# EAGLE design Joy2PS2_rev2_3 (EAGLE 7.6.0)
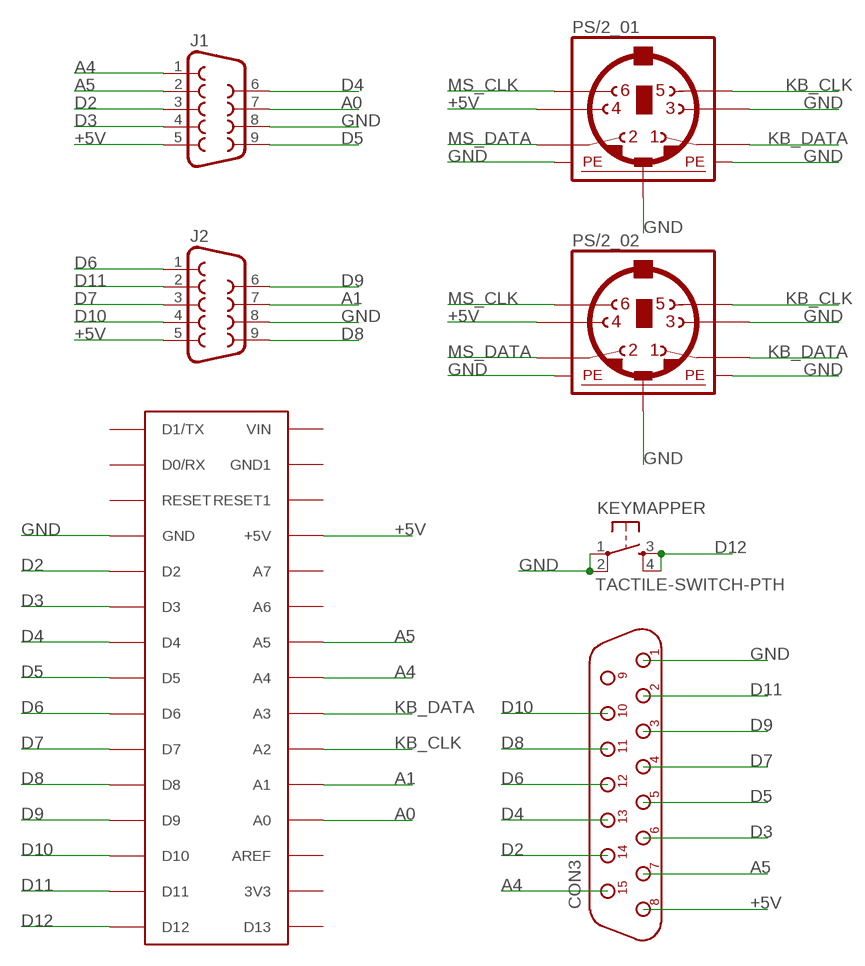
[diagram p0: schematic, sheet 1]

## Parts
ARDUINONANO  ARDUINONANO  [PDIP-32]
CON3  DB15M/90  [D-15M/90]
J1  DB9MALE  [DB9_MALE]
J2  DB9MALE  [DB9_MALE]
KEYMAPPER  TACTILE-SWITCH-PTH  [TAC-SWITCH-PTH]
PS/2_01  MINI_DIN_6  [M_DIN6]
PS/2_02  MINI_DIN_6  [M_DIN6]

## Nets
+5V: ARDUINONANO.+5V CON3.8 J1.5 J2.5 PS/2_01.4 PS/2_02.4
A0: ARDUINONANO.A0 J1.7
A1: ARDUINONANO.A1 J2.7
A4: ARDUINONANO.A4 CON3.15 J1.1
A5: ARDUINONANO.A5 CON3.7 J1.2
D2: ARDUINONANO.D2 CON3.14 J1.3
D3: ARDUINONANO.D3 CON3.6 J1.4
D4: ARDUINONANO.D4 CON3.13 J1.6
D5: ARDUINONANO.D5 CON3.5 J1.9
D6: ARDUINONANO.D6 CON3.12 J2.1
D7: ARDUINONANO.D7 CON3.4 J2.3
D8: ARDUINONANO.D8 CON3.11 J2.9
D9: ARDUINONANO.D9 CON3.3 J2.6
D10: ARDUINONANO.D10 CON3.10 J2.4
D11: ARDUINONANO.D11 CON3.2 J2.2
D12: ARDUINONANO.D12 KEYMAPPER.3 KEYMAPPER.4
GND: ARDUINONANO.GND CON3.1 J1.8 J2.8 KEYMAPPER.1 KEYMAPPER.2 PS/2_01.3 PS/2_01.SH1(PE1) PS/2_01.SH2(PE2) PS/2_01.SH3(PE3) PS/2_02.3 PS/2_02.SH1(PE1) PS/2_02.SH2(PE2) PS/2_02.SH3(PE3)
KB_CLK: ARDUINONANO.A2 PS/2_01.5 PS/2_02.5
KB_DATA: ARDUINONANO.A3 PS/2_01.1 PS/2_02.1
MS_CLK: PS/2_01.6 PS/2_02.6
MS_DATA: PS/2_01.2 PS/2_02.2
Unconnected: ARDUINONANO.3V3 ARDUINONANO.A6 ARDUINONANO.A7 ARDUINONANO.AREF ARDUINONANO.D0/RX ARDUINONANO.D1/TX ARDUINONANO.D13 ARDUINONANO.GND1 ARDUINONANO.RESET ARDUINONANO.RESET1 ARDUINONANO.VIN CON3.9

## Library data of the parts
ARDUINONANO = jet-lib2:ARDUINONANO
CON3 = connect:DB15M/90
J1 J2 = SparkFun-Connectors:DB9: DB9 Connector Standard DB9 (D-Sub 9) serial connector. Can be used for CAN bus as well as RS485 and RS232. Footprint production proven. Spark Fun Electronics SKU : PRT-00429; PROD_ID: CONN-09904
KEYMAPPER = GeekAmmo:TACTILE-SWITCH: Tactile Switch 4 Pins, SPST NO
PS/2_01 PS/2_02 = mini_din:MINI_DIN_6

## Board
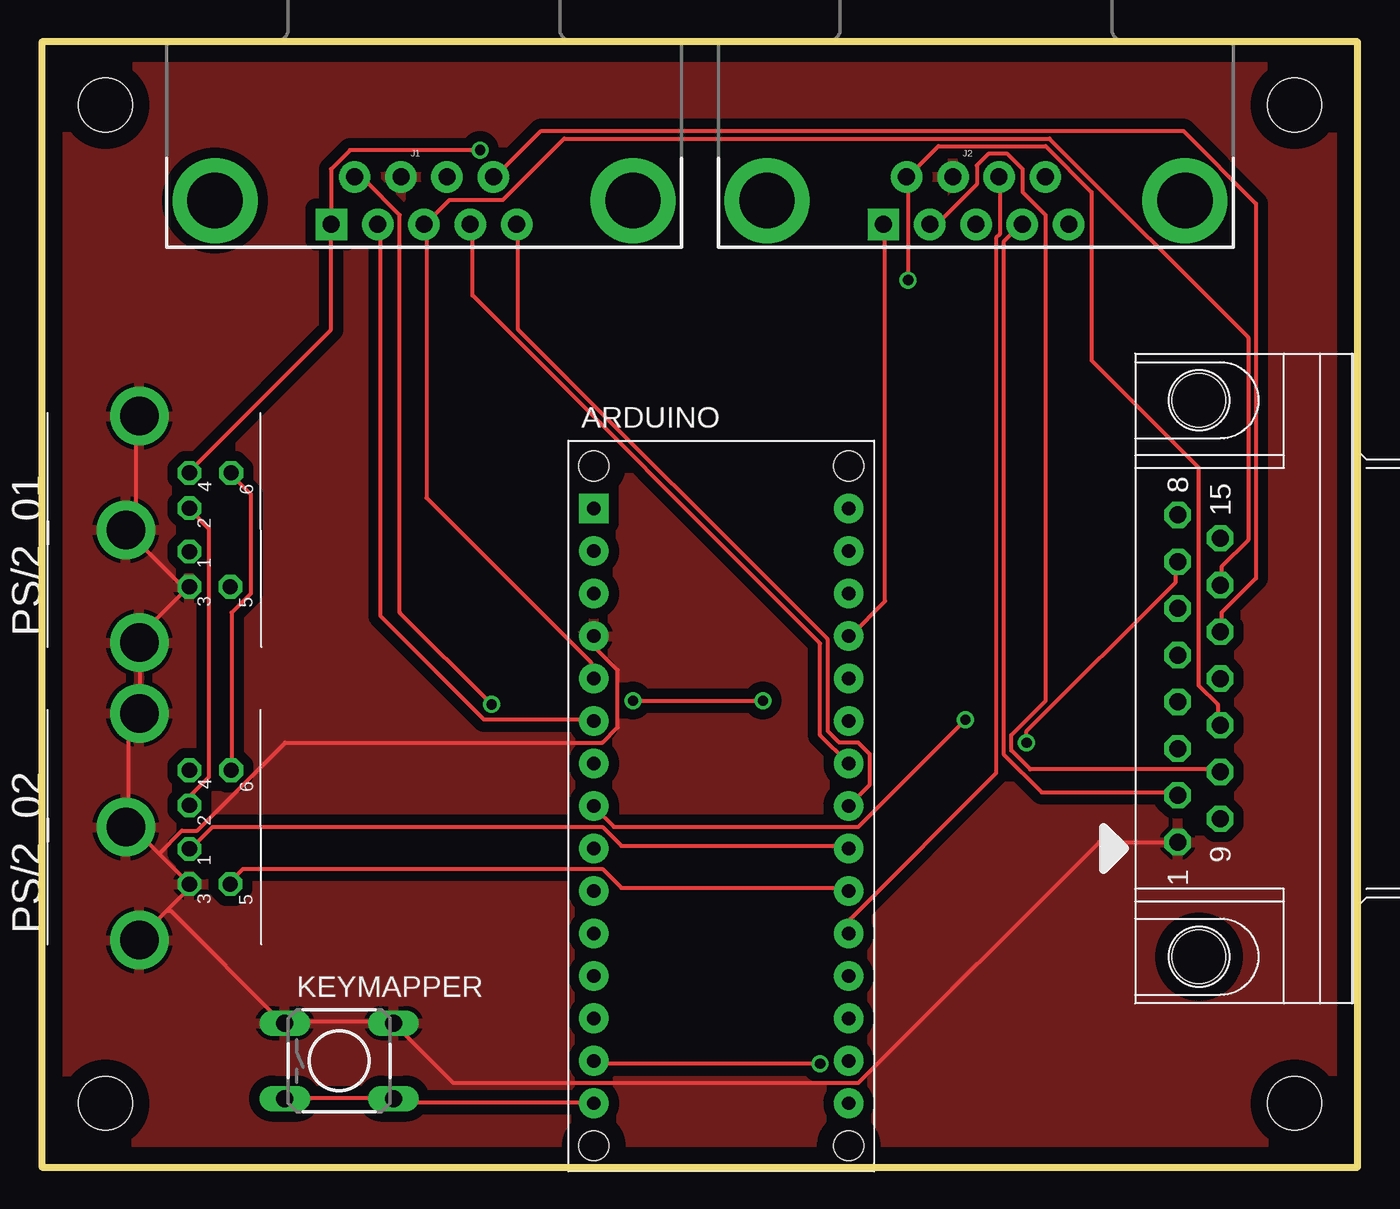
[diagram p1: board, top side]
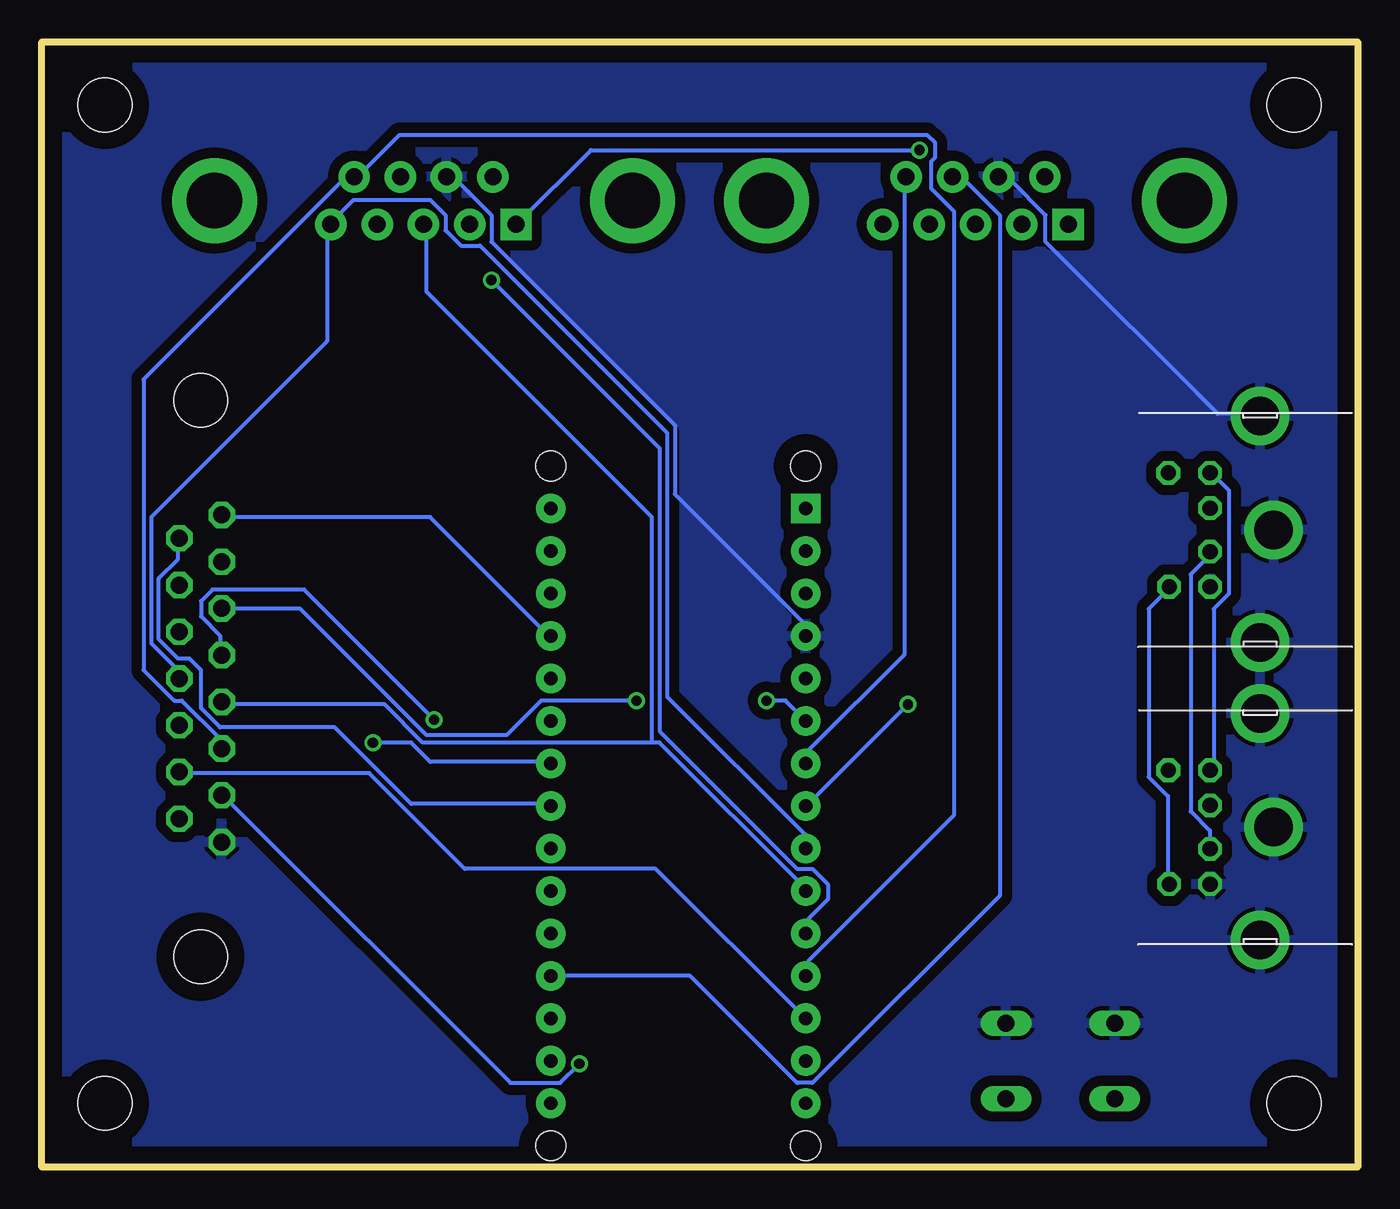
[diagram p2: board, bottom side, seen from below]

Size 78.71 x 67.28 mm. Coordinates in mm from the lower left corner, seen from the top.
Outline: 0,0 78.71,0 78.71,67.28 0,67.28 0,0
Copper layers (1*16): Top 0.035mm / dielectric 1.5mm / Bottom 0.035mm
Design rules "default": minimum track width 10mil, minimum drill 24mil, track to track 8mil, track to pad 8mil, pad to pad 8mil, via to via 8mil, smd to smd 8mil, copper to edge 40mil, drill to drill 8mil, minimum pad ring 10mil, minimum via ring 8mil, stop-mask expansion 4mil, vias tented up to drill 0mil, thermal gap 10mil
Holes 3.2 mm at 74.93,63.5 74.93,3.81 3.81,63.5 3.81,3.81

### Footprints (pad centres in the part's own frame; a part is rotated, then mirrored left to right if it is on the bottom)
PDIP-32 = drill 0.8 pad 1.778: 3V3 15.24,-35.56; +5V 15.24,-10.16; A0 15.24,-30.48; A1 15.24,-27.94; A2 15.24,-25.4; A3 15.24,-22.86; A4 15.24,-20.32; A5 15.24,-17.78; A6 15.24,-15.24; A7 15.24,-12.7; AREF 15.24,-33.02; D0/RX 0,-5.08; D2 0,-12.7; D3 0,-15.24; D4 0,-17.78; D5 0,-20.32; D6 0,-22.86; D7 0,-25.4; D8 0,-27.94; D9 0,-30.48; D10 0,-33.02; D11 0,-35.56; D12 0,-38.1; D13 15.24,-38.1; GND 0,-10.16; GND1 15.24,-5.08; RESET 0,-7.62; RESET1 15.24,-7.62; VIN 15.24,-2.54 | drill 0.8 pad 1.778 square: D1/TX 0,-2.54 | hole 1.778: 0,0; 0,-40.64; 15.24,-40.64; 15.24,0
D-15M/90 = drill 1.016 pad 1.575 octagon: 1 9.779,-1.27; 2 6.985,-1.27; 3 4.191,-1.27; 4 1.397,-1.27; 5 -1.397,-1.27; 6 -4.191,-1.27; 7 -6.985,-1.27; 8 -9.779,-1.27; 9 8.382,1.27; 10 5.588,1.27; 11 2.794,1.27; 12 0,1.27; 13 -2.794,1.27; 14 -5.588,1.27; 15 -8.382,1.27 | hole 3.2: 16.637,0; -16.637,0
DB9_MALE = drill 1.016 pad 1.88: 1 5.54,-1.42; 2 2.77,-1.42; 3 0,-1.42; 4 -2.77,-1.42; 6 4.15,1.42; 7 1.38,1.42; 8 -1.38,1.42; 9 -4.15,1.42 | drill 1.016 pad 1.88 square: 5 -5.54,-1.42 | drill 3.302 pad 5.08: G1 -12.5,0; G2 12.5,0
TAC-SWITCH-PTH = drill 1.016 pad 1.524 long: 1 -3.251,2.261; 2 3.251,2.261; 3 -3.251,-2.261; 4 3.251,-2.261
M_DIN6 = drill 0.9 pad 1.422 octagon: 1 -1.3,-3.75; 2 1.3,-3.75; 3 -3.4,-3.75; 4 3.4,-3.75; 5 -3.4,-6.2; 6 3.4,-6.25 | drill 2.3 pad 3.5: SH1 6.8,-0.75; SH2 0,0.05; SH3 -6.75,-0.75

### Placement (x,y rotation side)
ARDUINONANO  33.02,41.91 0 top
CON3  69.22,29.21 270 top
J1  22.86,57.78 0 top
J2  55.88,57.78 0 top
KEYMAPPER  17.78,6.35 0 top
PS/2_01  5.08,38.1 90 top
PS/2_02  5.08,20.32 90 top

### Tracks (layer width: path | path; a pad name or v marks a point on that pad's centre or on a via)
+5V  (via drill 0.61)
  Top 0.254: PS/2_01.4 8.84,41.6 17.3,50.06 17.3,56.24 J1.5 17.3,56.46 17.3,59.66 18.44,60.81 v26.21,60.81 | J2.5 50.44,56.24 50.44,33.83 48.39,31.77 ARDUINONANO.+5V
  Bottom 0.254: PS/2_02.4 8.61,23.77 8.61,33.38 7.7,34.29 7.7,40.46 8.61,41.38 PS/2_01.4 | CON3.8 67.82,38.86 55.47,38.86 48.39,31.77 ARDUINONANO.+5V | v26.21,60.81 45.87,60.81 50.22,56.46 J2.5
A0
  Bottom 0.254: ARDUINONANO.A0 39.93,11.43 33.53,5.03 32.61,5.03 21.41,16.23 21.41,56.92 23.47,58.98 24.16,58.98 J1.7
A1
  Top 0.254: ARDUINONANO.A1 48.39,14.17 48.39,14.86 57.07,23.55 57.07,55.55 57.3,55.78 57.3,58.98 J2.7
A4
  Top 0.254: ARDUINONANO.A4 49.53,22.86 49.53,24.69 48.84,25.38 47.7,25.38 47.02,26.06 47.02,31.55 28.5,50.06 28.5,56.24 J1.1
  Bottom 0.254: CON3.15 70.56,37.49 70.56,36.35 71.7,35.2 71.7,31.55 70.56,30.4 69.88,30.4 69.19,29.72 69.19,27.43 68.05,26.29 61.19,26.29 56.62,21.72 48.39,21.72 ARDUINONANO.A4
A5  (via drill 0.61)
  Top 0.254: v58.9,25.38 58.9,26.06 67.82,34.98 67.82,36.12 CON3.7 | ARDUINONANO.A5 46.56,25.83 46.56,31.32 25.76,52.12 25.76,56.24 J1.2
  Bottom 0.254: v58.9,25.38 56.62,25.38 55.47,24.23 48.39,24.23 ARDUINONANO.A5
D2
  Top 0.254: CON3.14 70.56,34.98 70.56,35.89 72.16,37.49 72.16,49.61 60.27,61.49 31.24,61.49 27.58,57.84 24.38,57.84 23.01,56.46 J1.3 23.01,56.24 23.01,40.01 32.84,30.18 32.84,29.26 ARDUINONANO.D2
D3  (via drill 0.61)
  Top 0.254: v35.36,27.89 v43.13,27.89 | J1.4 20.27,56.24 20.27,32.92 26.44,26.75 32.84,26.75 ARDUINONANO.D3
  Bottom 0.254: v43.13,27.89 48.84,27.89 50.9,25.83 55.7,25.83 63.25,33.38 67.82,33.38 CON3.6 | v35.36,27.89 34.21,27.89 33.07,26.75 ARDUINONANO.D3
D4
  Top 0.254: CON3.13 70.56,32 70.56,33.15 72.62,35.2 72.62,57.61 68.27,61.95 29.87,61.95 27.13,59.21 J1.6
  Bottom 0.254: ARDUINONANO.D4 32.84,24.23 32.84,24.92 27.13,30.63 27.13,58.98 J1.6
D5  (via drill 0.61)
  Top 0.254: v55.25,26.75 48.84,20.34 34.21,20.34 33.07,21.49 ARDUINONANO.D5 | v26.9,27.66 21.41,33.15 21.41,56.92 19.36,58.98 18.9,58.98 J1.9
  Bottom 0.254: v55.25,26.75 63.02,34.52 68.5,34.52 69.19,33.83 69.19,32.92 68.05,31.77 68.05,30.63 CON3.5 | v26.9,27.66 32.84,21.72 ARDUINONANO.D5
D6
  Bottom 0.254: CON3.12 70.56,29.26 70.56,29.72 72.16,31.32 72.16,38.86 61.65,49.38 61.65,56.24 J2.1 61.42,56.46 60.05,57.84 55.47,57.84 54.56,56.92 54.56,56.01 53.65,55.09 52.5,55.09 41.3,43.89 41.3,28.12 33.07,19.89 33.07,19.2 ARDUINONANO.D6
D7
  Bottom 0.254: 42.22,25.38 41.76,25.38 33.07,16.69 ARDUINONANO.D7 | 42.22,25.38 55.93,25.38 58.22,27.66 67.82,27.66 CON3.4 | 42.22,25.38 42.22,38.86 55.7,52.35 55.7,56.24 J2.3
D8  (via drill 0.61)
  Top 0.254: CON3.11 70.33,26.52 70.33,27.66 69.19,28.8 69.19,41.83 62.79,48.23 62.79,58.29 60.05,61.04 53.65,61.04 51.82,59.21 J2.9 51.82,58.98 v51.82,53.03
  Bottom 0.254: v51.82,53.03 41.76,42.98 41.76,26.06 33.53,17.83 32.61,17.83 31.7,16.92 31.7,16 32.84,14.86 32.84,14.17 ARDUINONANO.D8
D9
  Bottom 0.254: CON3.3 68.05,25.15 68.05,25.6 70.33,27.89 70.79,27.89 72.62,29.72 72.62,47.09 60.73,58.98 60.05,58.98 J2.6 59.82,59.21 57.3,61.72 25.76,61.72 25.3,61.27 25.3,60.35 25.53,60.12 25.53,58.52 24.16,57.15 24.16,21.03 32.84,12.34 32.84,11.43 ARDUINONANO.D9
D10
  Top 0.254: J2.4 53.19,56.46 53.65,56.46 55.93,58.75 55.93,59.89 56.62,60.58 57.76,60.58 58.67,59.66 58.67,58.29 60.05,56.92 60.05,27.89 57.99,25.83 57.99,24.92 59.13,23.77 70.33,23.77 CON3.10
  Bottom 0.254: CON3.10 70.33,23.55 59.13,23.55 53.42,17.83 41.99,17.83 33.07,8.91 ARDUINONANO.D10
D11  (via drill 0.61)
  Top 0.254: CON3.2 67.82,22.4 59.82,22.4 57.53,24.69 57.53,55.32 58.45,56.24 J2.2 | v46.56,6.17 33.07,6.17 ARDUINONANO.D11
  Bottom 0.254: v46.56,6.17 47.7,5.03 50.67,5.03 67.82,22.17 CON3.2
D12
  Top 0.254: KEYMAPPER.3 14.55,4.12 20.95,4.12 KEYMAPPER.4 21.18,3.89 32.84,3.89 ARDUINONANO.D12
GND
  Top 0.254: CON3.1 63.25,19.43 48.84,5.03 24.61,5.03 KEYMAPPER.2 20.95,8.69 14.55,8.69 KEYMAPPER.1 14.33,8.69 7.7,15.32 7.47,15.32 | 7.47,15.32 5.87,13.72 PS/2_02.SH3 | 7.47,15.32 8.61,16.46 8.61,16.92 PS/2_02.3 8.61,17.14 7.01,18.75 | 7.01,18.75 5.64,20.12 5.18,20.12 PS/2_02.SH2 5.18,20.34 5.18,26.52 5.64,26.98 PS/2_02.SH1 5.87,27.2 5.87,31.32 PS/2_01.SH3 5.64,31.55 8.61,34.52 | 8.61,34.52 5.18,37.95 PS/2_01.SH2 5.18,38.18 5.64,38.63 5.64,44.81 PS/2_01.SH1 | 8.61,34.52 PS/2_01.3 | 7.01,18.75 8.38,20.12 9.3,20.12 14.55,25.38 33.53,25.38 34.44,26.29 34.44,29.72 33.07,31.09 33.07,31.55 ARDUINONANO.GND
  Bottom 0.254: ARDUINONANO.GND 33.07,31.77 33.07,32.46 40.84,40.23 40.84,44.35 51.82,55.32 51.82,56.92 53.87,58.98 54.33,58.98 J2.8 | J1.8 21.41,58.98 20.73,58.98 18.67,56.92 18.67,55.32 8.38,45.03 5.87,45.03 PS/2_01.SH1
  pour Bottom (isolate 0.61): 0,67.31 78.74,67.31 78.74,0 0,0
  pour Top (isolate 0.61): 0,67.31 78.74,67.31 78.74,0 0,0
KB_CLK
  Top 0.254: ARDUINONANO.A2 48.16,16.69 34.67,16.69 33.53,17.83 12.04,17.83 11.35,17.14 PS/2_02.5
  Bottom 0.254: PS/2_02.5 11.35,17.14 11.35,22.17 12.5,23.32 12.5,33.38 11.35,34.52 PS/2_01.5
KB_DATA
  Top 0.254: ARDUINONANO.A3 48.16,19.2 34.67,19.2 33.53,20.34 10.21,20.34 8.84,18.97 PS/2_02.1
  Bottom 0.254: PS/2_02.1 8.84,19.2 8.84,20.12 9.98,21.26 9.98,35.43 8.84,36.58 PS/2_01.1
MS_CLK
  Top 0.254: PS/2_02.6 11.35,23.77 11.35,33.15 12.5,34.29 12.5,40.23 11.35,41.38 PS/2_01.6
MS_DATA
  Top 0.254: PS/2_02.2 8.84,21.72 8.84,22.17 9.98,23.32 9.98,38.18 8.84,39.32 PS/2_01.2